# EasyEDA Pro project ProPrj_Another Person's ESP32 FRC DevKit Lite_2025-10-14.epro, board PCB6
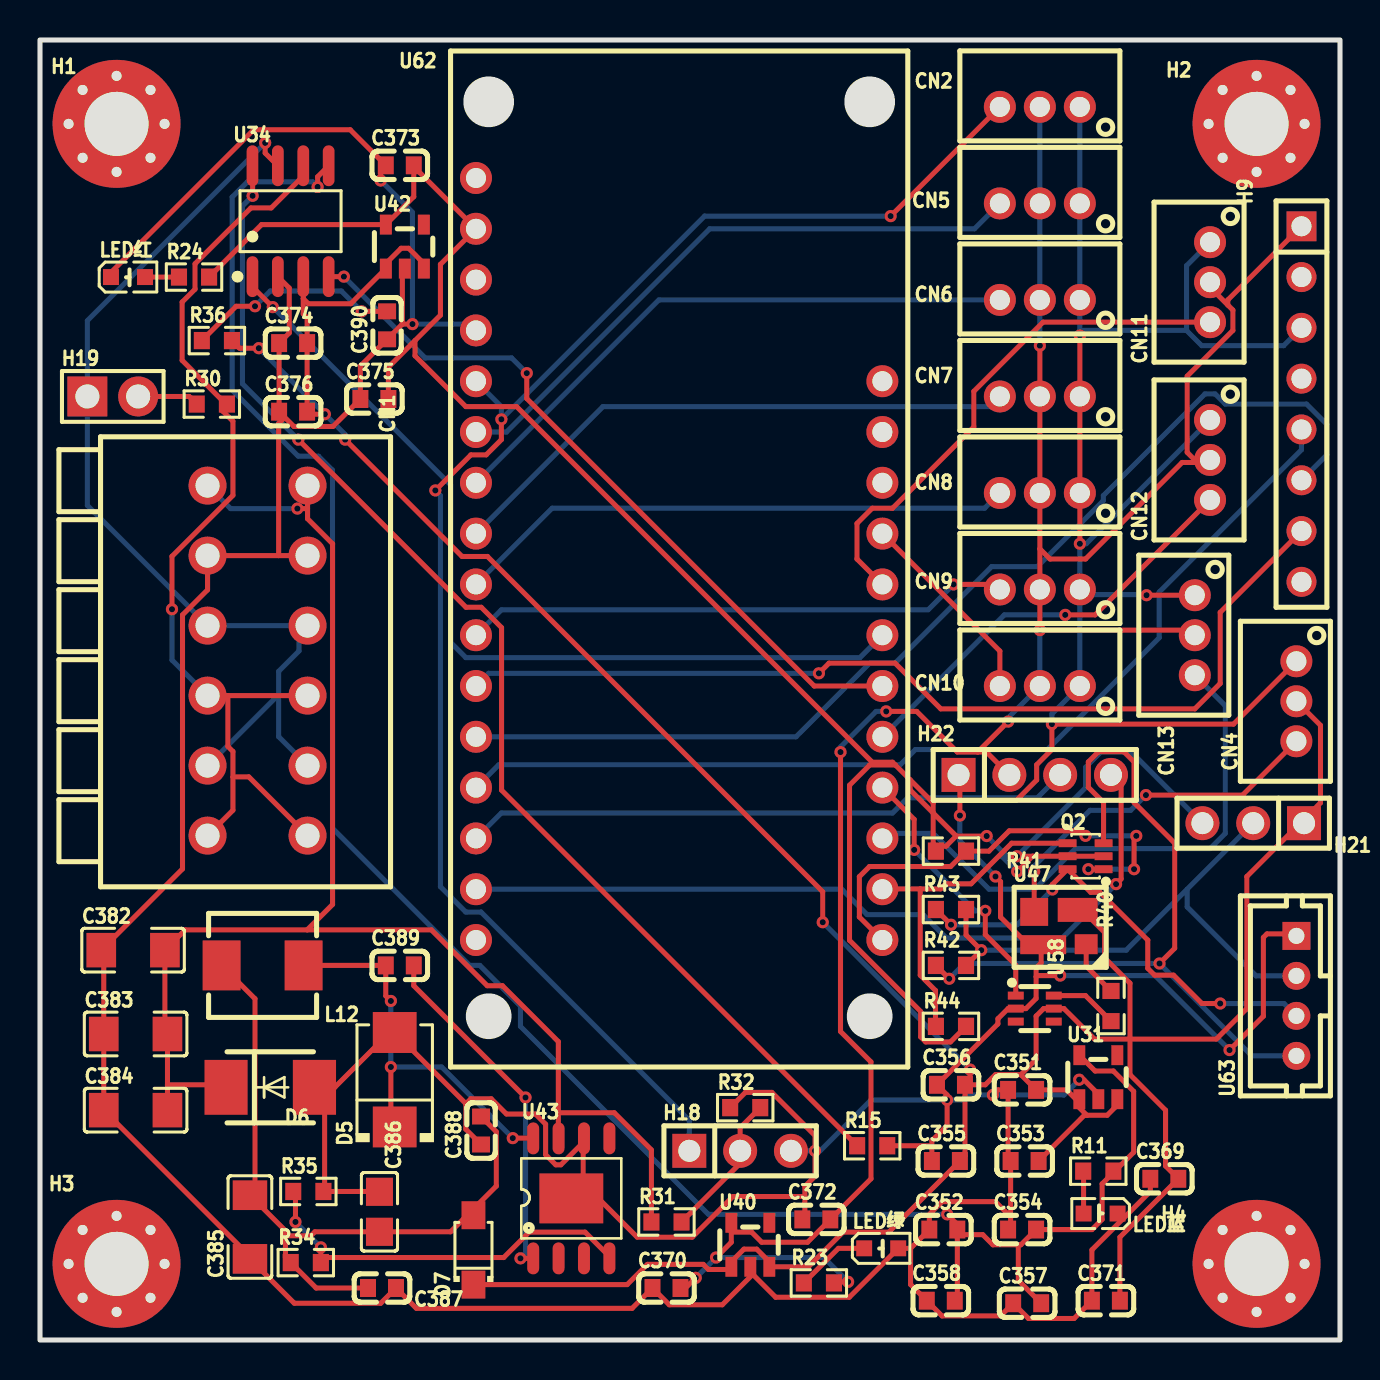
[diagram p9: board, top side]
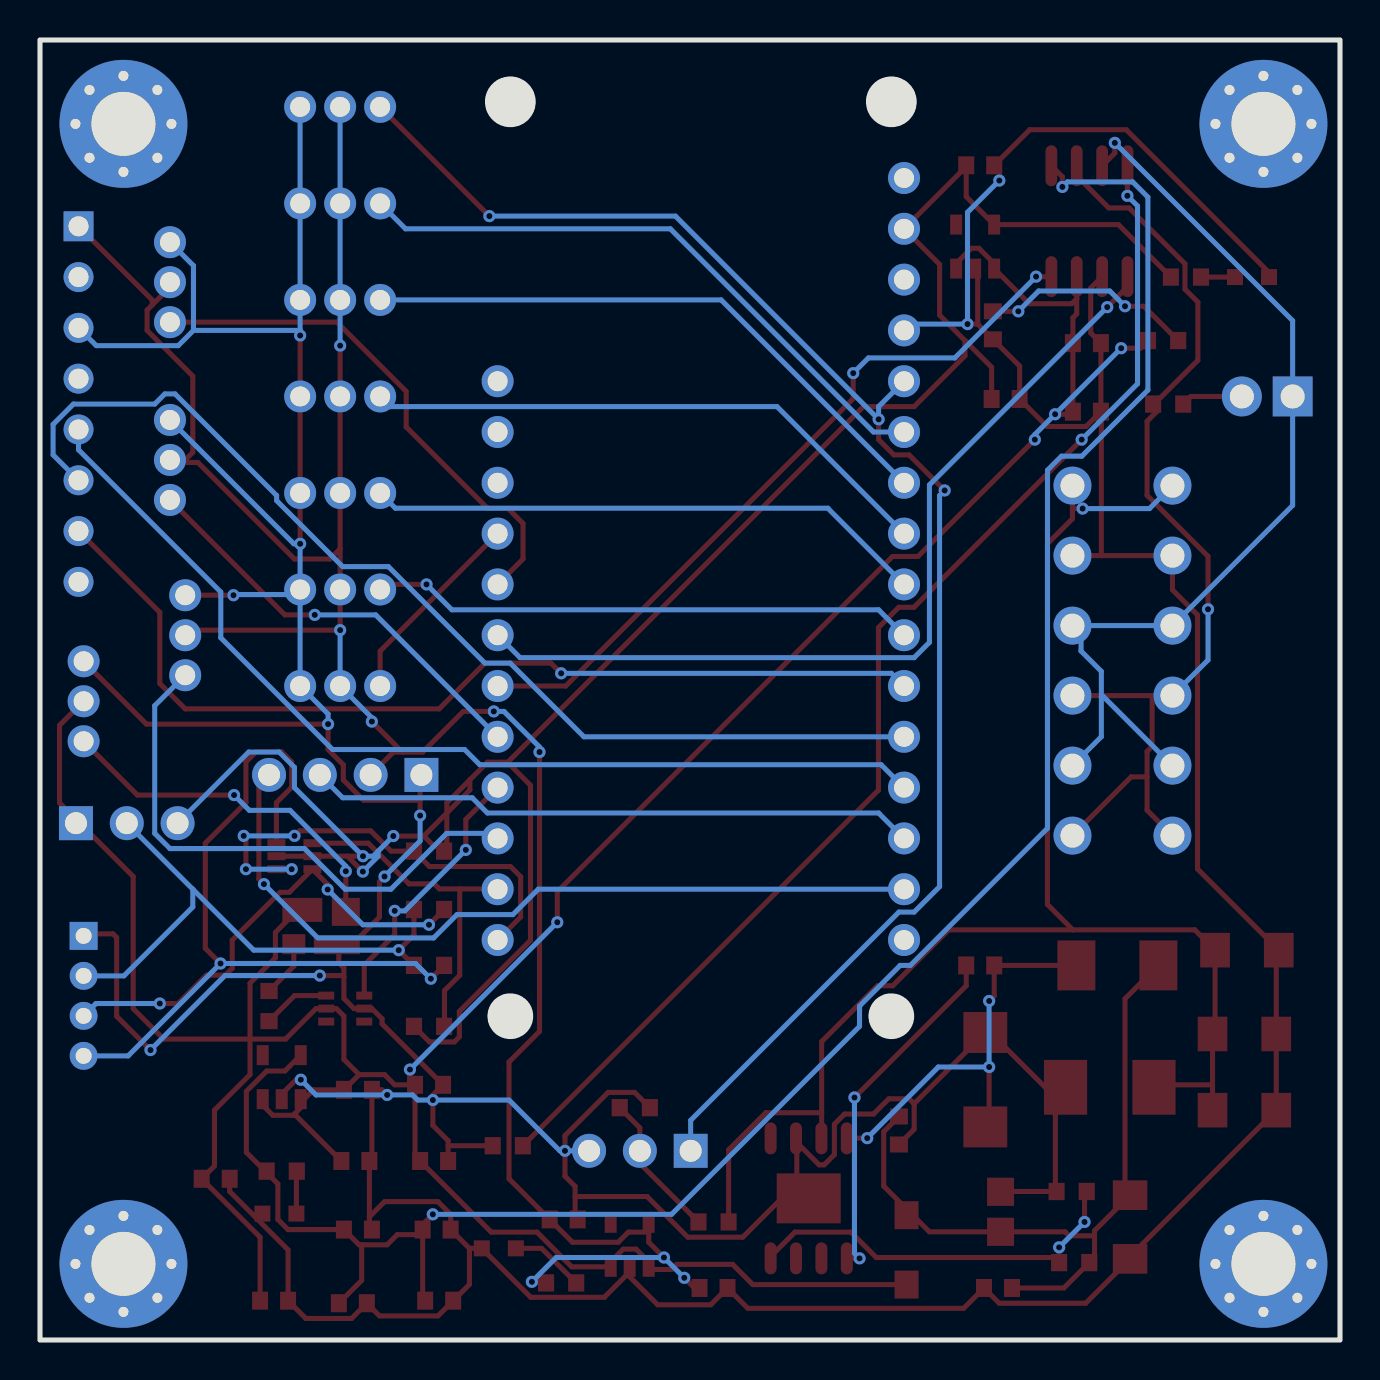
[diagram p10: board, bottom side, seen from below]

Outline 65 x 65 mm; copper layers: Top Layer, Bottom Layer. Coordinates in mm from the lower left corner of the outline.
Outline path: rectangle 0,65 65,0
Stack: Top Layer 0.035mm / Dielectric1 1.51mm FR4 er 4.5 / Bottom Layer 0.035mm

## Design rules (mm)
template: JLCPCB Capability(Two Layers Board)
spacing copperThickness1oz (default): track to track 0.102, other pairs 0.152 to 0.3
spacing copperThickness2oz: track to track 0.203, other pairs 0.152 to 0.3
track width copperThickness1oz (default): min 0.127, default 0.254, max 2.54
track width copperThickness2oz: min 0.203, default 0.254, max 2.54
differential pair differentialPair (default): width min 0.127, default 0.254, max 2.54; gap min 0.152, default 0.152
via viaSize (default): diameter min 0.5, default 0.61, max 10; hole min 0.3, default 0.305, max 6.3

## Placement (name value [footprint] x y rotation side)
C351  10uF  [C0603]  49.1 12.51 0 top
C352  10uF  [C0603]  45.17 5.52 0 top
C353  100nF  [C0603]  49.23 8.95 0 top
C354  100nF  [C0603]  49.1 5.52 0 top
C355  10uF  [C0603]  45.29 8.95 0 top
C356  100nF  [C0603]  45.55 12.76 0 top
C357  10uF  [C0603]  49.36 1.84 0 top
C358  100nF  [C0603]  45.04 1.97 0 top
C369  10uF  [C0603]  56.22 8.06 0 top
C370  10uF  [C0603]  31.32 2.6 0 top
C371  100nF  [C0603]  53.3 1.97 0 top
C372  100nF  [C0603]  38.82 6.03 0 top
C373  10uF  [C0603]  17.99 58.73 0 top
C374  100nF  [C0603]  12.66 49.84 0 top
C375  100nF  [C0603]  16.72 47.05 0 top
C376  10uF  [C0603]  12.66 46.42 0 top
C382  10uF  [C1206]  4.65 19.49 0 top
C383  22uF  [C1206]  4.78 15.3 0 top
C384  100nF  [C1206]  4.78 11.49 0 top
C385  47uF  [C1206]  10.5 5.65 90 top
C386  22uF  [C0805]  16.97 6.41 270 top
C387  10uF  [C0603]  17.1 2.6 180 top
C388  100nF  [C0603]  22.05 10.47 90 top
C389  100nF  [C0603]  17.99 18.73 0 top
C390  4.7uF  [C0603]  17.35 50.73 90 top
CN1  New_Library_2601-1106  [CONN-TH_2601-1106]  10.88 33.97 270 top
CN2  B3B-PH-K-S(LF)(SN)  [CONN-TH_B3B-PH-K-S]  49.99 61.66 0 top
CN4  B3B-PH-K-S(LF)(SN)  [CONN-TH_B3B-PH-K-S]  62.82 31.94 90 top
CN5  B3B-PH-K-S(LF)(SN)  [CONN-TH_B3B-PH-K-S]  49.99 56.83 0 top
CN6  B3B-PH-K-S(LF)(SN)  [CONN-TH_B3B-PH-K-S]  49.99 52 0 top
CN7  B3B-PH-K-S(LF)(SN)  [CONN-TH_B3B-PH-K-S]  49.99 47.18 0 top
CN8  B3B-PH-K-S(LF)(SN)  [CONN-TH_B3B-PH-K-S]  49.99 42.35 0 top
CN9  B3B-PH-K-S(LF)(SN)  [CONN-TH_B3B-PH-K-S]  49.99 37.53 0 top
CN10  B3B-PH-K-S(LF)(SN)  [CONN-TH_B3B-PH-K-S]  49.99 32.7 0 top
CN11  B3B-PH-K-S(LF)(SN)  [CONN-TH_B3B-PH-K-S]  58.5 52.89 90 top
CN12  B3B-PH-K-S(LF)(SN)  [CONN-TH_B3B-PH-K-S]  58.5 44 90 top
CN13  B3B-PH-K-S(LF)(SN)  [CONN-TH_B3B-PH-K-S]  57.74 35.24 90 top
D5  SS54SMB  [SMB_L4.6-W3.6-LS5.3-RD]  17.74 13.01 90 top
D6  SMBJ28A  [SMB_L4.6-W3.6-LS5.3-L-FD]  11.51 12.63 180 top
D7  DSK34  [SOD-123FL_L2.7-W1.8-LS3.8-RD]  21.67 4.51 90 top
H1  Hole_Pad  [MountingHole:MountingHole_3.2mm_M3_Pad_Via]  3.83 60.81 0 top
H2  Hole_Pad  [MountingHole:MountingHole_3.2mm_M3_Pad_Via]  60.83 60.81 0 top
H3  Hole_Pad  [MountingHole:MountingHole_3.2mm_M3_Pad_Via]  3.83 3.81 0 top
H4  Hole_Pad  [MountingHole:MountingHole_3.2mm_M3_Pad_Via]  60.83 3.81 0 top
H9  PZ254V-11-08P  [HDR-TH_8P-P2.54-V-M]  63.07 46.8 270 top
H18  PZ254V-11-03P  [HDR-TH_3P-P2.54-V-M]  35.01 9.46 0 top
H19  PZ254V-11-02P  [HDR-TH_2P-P2.54-V-M]  3.64 47.18 0 top
H21  PZ254V-11-03P  [HDR-TH_3P-P2.54-V-M]  60.66 25.84 180 top
H22  PZ254V-11-04P  [HDR-TH_4P-P2.54-V-M]  49.74 28.25 0 top
L12  10uH  [IND-SMD_L5.4-W5.2_FXL0530]  11.13 18.73 180 top
LED红  SZYY0603R  [LED0603-R-RD]  4.4 53.15 0 top
LED绿  XL-1608PGC-06  [LED0603-RD_GREEN]  42.12 4.63 0 top
LED蓝  SZYY0603B  [LED0603-R-RD_BLUE]  53.04 6.28 180 top
Q2  BSS138BKS,115  [SOT-363_L2.0-W1.3-P0.65-LS2.1-BR]  52.28 24.19 0 top
R11  10kΩ  [R0603]  52.91 8.44 0 top
R15  0Ω  [R0603]  41.61 9.71 0 top
R23  10kΩ  [R0603]  38.94 2.85 0 top
R24  10kΩ  [R0603]  7.7 53.15 0 top
R30  120Ω  [R0603]  8.59 46.8 0 top
R31  82kΩ  [R0603]  31.32 5.9 0 top
R32  10kΩ  [R0603]  35.26 11.62 0 top
R34  10kΩ  [R0603]  13.29 3.87 0 top
R35  31.3kΩ  [R0603]  13.42 7.43 0 top
R36  470kΩ  [R0603]  8.84 49.97 0 top
R40  500  [R0603]  53.55 16.7 270 top
R41  10kΩ  [R0603]  45.55 24.44 180 top
R42  10kΩ  [R0603]  45.55 18.73 0 top
R43  10kΩ  [R0603]  45.55 21.52 0 top
R44  10kΩ  [R0603]  45.55 15.68 0 top
U31  ME6211C30M5G-N  [SOT-23-5_L2.9-W1.6-P0.95-LS2.8-BL]  52.91 13.14 0 top
U34  TJA1051T/3/1J  [SOIC-8_L4.9-W3.9-P1.27-LS6.0-BL]  12.53 55.94 0 top
U40  ME6211C30M5G-N  [SOT-23-5_L2.9-W1.6-P0.95-LS2.8-BL]  35.52 4.76 0 top
U42  ME6211C30M5G-N  [SOT-23-5_L2.9-W1.6-P0.95-LS2.8-BL]  18.24 54.67 0 top
U43  TPS5450MDDAREP  [POWERPAD-SO-8_L4.9-W3.9-P1.27-LS6.0-BL-EP]  26.56 7.08 0 top
U47  SK6812MINI-C  [LED-SMD_4P-L3.5-W3.5-R-SK6812MINI]  51.01 20.63 0 top
U58  74HCT2G34GW,125  [SC-88-6_L2.0-W1.3-P0.65-LS2.1-BL]  49.74 16.57 270 top
U62  ESP32-C6-Feather  [COMM-TH_L50.8-W22.9-P2.54-LS20.32]  31.96 39.05 270 top
U63  B4B-PH-K(LF)(SN)  [CONN-TH_B4B-PH-K-LF-SN]  62.82 17.21 90 top

## Footprints (pads in the part's own frame, mm; a bottom-side part is the same pattern mirrored in y, then rotated)
C0603
  rect 0.8x0.9 smd: 1(-0.7,0) 2(0.7,0)
C0805
  rect 1.41x1.35 smd: 1(-1,0) 2(1,0)
C1206
  rect 1.485x1.728 smd: 1(-1.593,0) 2(1.593,0)
COMM-TH_L50.8-W22.9-P2.54-LS20.32
  round 1.6 hole 1: 1(-19.05,-10.16) 2(-16.51,-10.16) 3(-13.97,-10.16) 4(-11.43,-10.16) 5(-8.89,-10.16) 6(-6.35,-10.16) 7(-3.81,-10.16) 8(-1.27,-10.16) 9(1.27,-10.16) 10(3.81,-10.16) 11(6.35,-10.16) 12(8.89,-10.16) 13(11.43,-10.16) 14(13.97,-10.16) 15(16.51,-10.16) 16(19.05,-10.16) 17(19.05,10.16) 18(16.51,10.16) 19(13.97,10.16) 20(11.43,10.16) 21(8.89,10.16) 22(6.35,10.16) 23(3.81,10.16) 24(1.27,10.16) 25(-1.27,10.16) 26(-3.81,10.16) 27(-6.35,10.16) 28(-8.89,10.16)
CONN-TH_2601-1106
  round 1.9 hole 1.2: 1(-8.75,2.5) 1(-8.75,-2.5) 2(-5.25,2.5) 2(-5.25,-2.5) 3(-1.75,2.5) 3(-1.75,-2.5) 4(1.75,2.5) 4(1.75,-2.5) 5(5.25,2.5) 5(5.25,-2.5) 6(8.75,2.5) 6(8.75,-2.5)
CONN-TH_B3B-PH-K-S
  round 1.6 hole 1: 1(2,0) 2(0,0) 3(-2,0)
CONN-TH_B4B-PH-K-LF-SN
  rect 1.4x1.4 hole 0.8: 1(3,0)
  round 1.4 hole 0.8: 2(1,0) 3(-1,0) 4(-3,0)
HDR-TH_2P-P2.54-V-M
  rect 2x2 hole 1.2: 1(-1.27,0)
  round 2 hole 1.2: 2(1.27,0)
HDR-TH_3P-P2.54-V-M
  rect 1.7x1.7 hole 1.1: 1(-2.54,0)
  round 1.7 hole 1.1: 2(0,0) 3(2.54,0)
HDR-TH_4P-P2.54-V-M
  rect 1.7x1.7 hole 1.1: 1(-3.81,0)
  round 1.7 hole 1.1: 2(-1.27,0) 3(1.27,0) 4(3.81,0)
HDR-TH_8P-P2.54-V-M
  rect 1.5x1.5 hole 1: 1(-8.89,0)
  round 1.5 hole 1: 2(-6.35,0) 3(-3.81,0) 4(-1.27,0) 5(1.27,0) 6(3.81,0) 7(6.35,0) 8(8.89,0)
IND-SMD_L5.4-W5.2_FXL0530
  rect 1.9x2.5 smd: 1(-2.05,0) 2(2.05,0)
LED0603-R-RD
  rect 0.8x0.8 smd: 1(0.851,0) 2(-0.851,0)
LED0603-R-RD_BLUE
  rect 0.8x0.8 smd: 1(0.862,-0.038) 2(-0.841,-0.038)
LED0603-RD_GREEN
  rect 0.8x0.8 smd: 1(0.791,-0.05) 2(-0.911,-0.05)
LED-SMD_4P-L3.5-W3.5-R-SK6812MINI
  rect 1.15x1 smd: 1(1.3,-0.845)
  rect 2x1.2 smd: 2(0.875,0.87)
  rect 1.4x1.4 smd: 3(-1.3,0.77)
  rect 2.3x0.95 smd: 4(-0.85,-0.87)
MountingHole:MountingHole_3.2mm_M3_Pad_Via
  round 0.8 hole 0.5: 1(-2.4,0) 1(-1.697,1.697) 1(-1.697,-1.697) 1(0,2.4) 1(0,-2.4) 1(1.697,1.697) 1(1.697,-1.697) 1(2.4,0)
  round 6.4 hole 3.2: 1(0,0)
POWERPAD-SO-8_L4.9-W3.9-P1.27-LS6.0-BL-EP
  oval 0.6x1.6 smd: 1(-1.905,-3) 2(-0.635,-3) 3(0.635,-3) 4(1.905,-3) 5(1.905,3) 6(0.635,3) 7(-0.635,3) 8(-1.905,3)
  rect 3.2x2.5 smd: 9(0,0)
R0603
  rect 0.806x0.864 smd: 1(-0.753,0) 2(0.753,0)
SC-88-6_L2.0-W1.3-P0.65-LS2.1-BL
  rect 0.4x0.8 smd: 1(-0.65,-0.95) 2(0,-0.95) 3(0.65,-0.95) 4(0.65,0.95) 5(0,0.95) 6(-0.65,0.95)
SMB_L4.6-W3.6-LS5.3-L-FD
  rect 2.159x2.743 smd: 1(-2.21,0) 2(2.21,0)
SMB_L4.6-W3.6-LS5.3-RD
  rect 2.047x2.192 smd: 1(-2.361,0) 2(2.361,0)
SOD-123FL_L2.7-W1.8-LS3.8-RD
  rect 1.4x1.2 smd: 1(-1.735,0) 2(1.735,0)
SOIC-8_L4.9-W3.9-P1.27-LS6.0-BL
  oval 0.588x2.045 smd: 1(-1.905,-2.772) 2(-0.635,-2.772) 3(0.635,-2.772) 4(1.905,-2.772) 5(1.905,2.772) 6(0.635,2.772) 7(-0.635,2.772) 8(-1.905,2.772)
SOT-23-5_L2.9-W1.6-P0.95-LS2.8-BL
  rect 0.6x1 smd: 1(-0.95,-1.1) 2(0,-1.1) 3(0.95,-1.1) 4(0.95,1.1) 5(-0.95,1.1)
SOT-363_L2.0-W1.3-P0.65-LS2.1-BR
  rect 0.9x0.4 smd: 1(0.9,-0.65) 2(0.9,0) 3(0.9,0.65) 4(-0.9,0.65) 5(-0.9,0) 6(-0.9,-0.65)

## Nets
As in the schematic.

Pads without a net: H1 1; H2 1; H3 1; H4 1; H9 4; U31 4; U40 4; U42 4; U43 2 3 5; U58 3 4; U62 1 3 16 26 27 28

## Via types
v1: diameter 0.61, hole 0.305, Top Layer to Bottom Layer, 70 vias

## Routing (per net, layer and track width the routed paths; a pad name or vN(x,y) marks a point on that pad's centre or on a via; arc(x,y) is an arc through that point)
3V3: length 106.1
  Top Layer w0.254: 48.91,4.76 49.04,4.76 C354.2 52.6,5.52 53.11,6.03 53.11,7.81 53.67,8.37 ; 48.91,4.76 47.65,4.76 47.14,5.27 45.87,5.27 ; 48.91,4.76 48.91,2.98 C357.2 ; U34.5 13.88,58.16 v1(13.88,57.65) ; v1(45.36,6.28) 45.87,5.78 C352.2 45.87,5.27 ; 45.87,5.27 45.87,2.09 C358.2 ; 51.96,14.24 52.76,13.45 53.67,13.45 54.68,12.43 54.68,9.38 53.67,8.37 ; 53.67,8.37 R11.2
  Bottom Layer w0.254: v1(13.88,57.65) 13.63,57.91 10.37,57.91 9.61,57.15 9.61,47.49 12.91,44.19 13.93,44.19 14.62,43.49 14.62,25.59 21.48,18.73 21.99,18.73 24.02,16.7 24.02,15.68 33.42,6.28 v1(45.36,6.28)
3V3_POWER: length 114.7
  Top Layer w0.254: R24.2 11.08,55.77 U42.5 18.69,57.17 18.69,58.67 ; 43.51,28.01 44.66,26.86 44.66,26.35 ; 43.51,28.01 43.51,27.5 44.66,26.35 ; 43.51,28.01 42.76,28.75 ; 45.81,25.2 v1(47.33,25.2) ; 45.81,25.2 44.66,26.35 ; 45.81,25.2 45.3,24.69 44.79,24.69 ; 17.42,47.05 17.42,48.64 18.75,49.97 ; 18.75,49.97 18.75,49.21 21.29,46.67 23.83,46.67 41.61,28.89 42.63,28.89 42.76,28.75 ; 18.75,49.97 20.02,51.24 20.02,53.78 U62.2 18.69,58.67 ; v1(48.86,23.42) 49.63,24.19 ; 49.63,24.19 v1(48.85,24.19) ; 49.63,24.19 Q2.5 Q2.2 ; 18.69,58.67 C373.2 ; 44.79,24.69 44.66,24.83 44.66,26.35 ; 44.79,24.69 R41.2 ; 42.76,28.75 41.49,28.75 40.48,27.74 40.48,19.98 44.03,16.43 44.03,15.16 44.29,14.9 45.52,14.9 R44.2
  Bottom Layer w0.254: v1(48.86,23.42) 48.1,24.18 48.1,24.44 ; v1(47.33,25.2) 48.1,24.44 ; 48.1,24.44 48.34,24.19 v1(48.85,24.19) 52.28,27.62 52.28,28.64 53.04,29.4 54.56,29.4 H21.3
+5V: length 170.2
  Top Layer w0.254: 54.5,15.05 52.72,15.05 51.2,16.57 U58.5 50.18,16.57 49.8,16.19 49.8,14.03 49.04,13.27 ; 54.5,15.05 54.5,13.27 56.28,11.49 56.28,8.7 C369.2 54,5.14 C371.2 ; 54.5,15.05 54.5,17.84 53.23,19.11 53.23,20.38 52.33,21.28 52.11,21.28 U47.2 ; 54.5,15.05 58.82,15.05 60.34,16.57 60.34,23.17 63.01,25.84 ; 46.5,12.76 v1(46.5,13.52) ; 46.5,12.76 C356.2 46.25,9.2 C355.2 42.44,5.39 40.15,5.39 38.42,3.66 U40.3 36.47,3.91 35.84,4.54 35.19,4.54 34.69,4.04 34.69,3.78 34.43,3.53 33.42,3.53 33.16,3.78 30.37,3.78 29.36,2.77 D7.1 ; 46.5,12.76 47.26,12.76 47.77,13.27 49.04,13.27 ; v1(14.24,46.29) 13.48,46.29 C376.2 C374.2 13.35,51.11 13.16,51.31 13.16,52.07 ; 13.16,52.07 13.42,51.81 15.54,51.81 U42.1 17.29,53.82 18.06,54.59 18.43,54.59 19.19,53.82 U42.3 ; 13.16,52.07 13.16,53.17 ; 51.84,12 U31.1 ; 51.84,12 51.33,12.51 C351.2 49.04,13.27 ; 51.84,12 51.84,11.74 52.34,11.24 ; v1(15.26,45.02) 21.1,39.18 22.37,39.18 39.14,22.41 v1(39.14,20.89) ; 63.01,25.84 64.02,26.86 64.02,30.73 CN4.2 ; 63.01,25.84 H21.1 ; R36.2 9.98,49.59 v1(10.94,49.59) ; 49.93,8.95 52.22,11.24 52.34,11.24 ; 52.34,11.24 53.36,11.24 53.86,11.74 U31.3
  Bottom Layer w0.254: v1(15.26,45.02) 15.26,45.27 v1(14.24,46.29) v1(10.94,49.59) ; v1(46.5,13.52) v1(39.14,20.89)
GND: length 378.1
  Top Layer w0.254: 38.24,7.17 34.64,7.17 32.61,5.14 29.86,5.14 27.92,7.08 27.16,7.08 ; 38.24,7.17 38.24,7.68 38.75,8.19 v1(38.75,9.46) 38.75,10.22 36.59,12.38 35.27,12.38 R32.1 ; 38.24,7.17 38.24,6.16 38.12,6.03 ; 21.29,11.81 21.29,11.82 D5.2 17.48,15.38 14.74,12.63 14.23,12.63 ; 21.29,11.81 21.55,12.06 22.56,12.06 23.32,11.3 24.77,11.3 25.28,10.79 25.28,9.27 25.79,8.76 26.04,8.76 27.16,9.88 ; 21.29,11.81 21.29,10.54 C388.1 ; v1(17.03,57.97) 17.03,58.48 C373.1 15.51,60.51 10.69,60.51 3.55,53.38 LED红.2 ; 54.12,6.03 52.59,4.51 C371.1 51.71,1.08 49.42,1.08 C357.1 48.02,1.2 45.1,1.2 C358.1 43.53,2.78 43.53,4.58 ; 54.12,6.03 55.52,7.43 C369.1 ; 54.12,6.03 54.12,6.08 LED蓝.2 ; v1(46,26.22) 46,26.98 ; 46,26.98 46,28.19 H22.1 ; 46,26.98 48.82,26.98 49.83,28 49.83,28.76 50.6,29.52 v1(50.6,30.79) 59.68,30.79 CN4.1 ; 48.53,6.16 47.77,6.92 45.1,6.92 44.47,6.28 C352.1 43.53,4.58 ; 48.53,6.16 C353.1 48.4,9.08 C351.1 47.9,12.51 v1(47.64,12.25) ; 48.53,6.16 48.53,5.65 C354.1 ; 43.53,4.58 LED绿.1 40.46,2.14 36.78,2.14 35.64,3.28 ; 50.06,19.62 49.55,19.62 48.03,21.14 48.03,22.92 v1(47.77,23.17) ; 50.06,19.62 50.06,19.66 U47.4 ; 50.06,19.62 50.06,18.86 49.81,18.6 49.81,18.16 ; 27.16,7.08 U43.9 ; 27.16,7.08 27.16,9.88 ; 11.93,39.22 CN1.2 ; 11.93,39.22 CN1.2 8.38,37.51 7.13,36.26 7.13,23.56 C382.1 3.19,19.36 C383.1 C384.1 10.5,4.18 C385.1 12.71,1.84 17.04,1.84 C387.1 18.82,1.58 29.61,1.58 C370.1 31.47,1.76 34.11,1.76 35.64,3.28 ; 11.93,39.22 11.93,45.82 12.19,46.08 12.19,46.18 ; v1(51.99,39.81) CN8.1 CN7.1 v1(51.99,50.23) ; v1(51.96,13.01) 52.19,13.01 52.91,12.3 U31.2 ; U42.2 18.12,53.44 18.12,50.8 ; U34.2 12.46,52.6 12.46,50.35 C374.1 C376.1 12.19,46.18 ; 49.81,18.16 49.81,17.08 49.3,16.57 U58.2 48.4,16.57 47.9,16.06 47.9,15.81 C356.1 45.36,12.25 v1(45.36,12) 45.36,10.73 44.59,9.97 44.59,9.71 ; 49.81,18.16 49.87,18.22 v1(51.01,18.22) ; U40.2 35.64,3.54 35.64,3.28 ; 12.19,46.18 12.69,45.68 14.64,45.68 C375.1 16.02,48.7 C390.1 18.12,50.8 ; 27.16,9.88 U43.6 ; C386.1 16.96,7.43 R35.2 14.23,7.49 14.23,12.63 ; v1(55.33,37.24) CN13.1 ; 44.59,9.71 C355.1 ; 44.59,9.71 R15.2 ; 18.12,50.8 v1(18.62,50.8) ; 14.23,12.63 D6.1 ; v1(59.48,14.5) 61.17,16.19 61.17,20.13 61.35,20.31 62.72,20.31 U63.1
  Bottom Layer w0.254: 51.99,50.48 57.33,50.48 ; 51.99,50.48 v1(51.99,50.23) ; 51.99,50.48 CN6.1 CN5.1 CN2.1 ; 57.33,50.48 57.33,53.72 CN11.1 ; 57.33,50.48 58.09,49.72 62.19,49.72 H9.3 ; 51.99,37.27 CN10.1 50.6,31.3 v1(50.6,30.79) ; 51.99,37.27 CN9.1 v1(51.99,39.81) 52.31,39.81 CN12.1 ; 51.99,37.27 55.3,37.27 v1(55.33,37.24) ; v1(46,26.22) 46,24.95 v1(47.77,23.17) ; v1(59.48,14.5) 55.75,18.22 v1(51.01,18.22) ; v1(17.03,57.97) 18.62,56.38 v1(18.62,50.8) 21.48,50.8 U62.4 ; H18.3 39.01,9.46 41.55,12 v1(45.36,12) 46.12,12 46.37,12.25 v1(47.64,12.25) 51.2,12.25 v1(51.96,13.01)
VCC: length 76
  Top Layer w0.254: 6.37,12.76 C384.2 ; 6.37,12.76 C383.2 6.25,15.43 C382.2 7.26,20.51 13.36,20.51 ; 6.37,12.76 9.18,12.76 D6.2 ; R31.1 30.57,9.5 28.71,11.36 25.92,11.36 ; 13.38,41.57 13.38,41.06 14.63,39.81 14.63,21.78 13.36,20.51 ; 13.38,41.57 v1(12.87,41.57) ; 13.38,41.57 CN1.1 ; 25.92,11.36 25.92,10.09 U43.7 ; 25.92,11.36 25.92,14.92 23.12,17.71 22.36,17.71 19.57,20.51 13.36,20.51
  Bottom Layer w0.254: v1(12.87,41.57) 9.53,41.57 CN1.1
3.3_SENSOR: length 121.8
  Top Layer w0.254: 57.87,43.88 58.38,43.88 CN12.2 ; 57.87,43.88 57.36,44.38 57.36,48.19 59.65,50.48 59.65,51.5 59.39,51.75 ; 57.87,43.88 57.1,43.88 52.28,39.05 50.5,39.05 49.99,39.56 ; 46.88,29.4 v1(48.41,30.92) ; 46.88,29.4 45.87,29.4 43.84,31.43 v1(42.31,31.43) ; 46.88,29.4 47.33,29.4 H22.2 ; v1(32.79,3.11) 32.28,2.6 C370.2 ; R23.2 39.75,2.91 v1(40.41,2.91) ; CN11.2 58.5,52.64 59.39,51.75 ; v1(40.03,29.4) 40.03,15.43 41.55,13.9 41.55,8.06 C372.2 38.37,4.89 36.09,4.89 35.58,5.39 34.56,5.39 ; 59.39,51.75 59.39,52 H9.1 ; 34.56,5.39 34.56,4.89 v1(33.8,4.12) ; 34.56,5.39 34.56,5.86 ; v1(49.99,49.72) CN7.2 CN8.2 49.99,39.56 ; CN13.2 57.49,35.49 v1(49.99,35.49) CN9.2 49.99,39.56
  Bottom Layer w0.254: CN2.2 CN5.2 CN6.2 v1(49.99,49.72) ; v1(32.79,3.11) v1(33.8,4.12) 39.19,4.12 v1(40.41,2.91) ; v1(40.03,29.4) 40.03,29.65 41.8,31.43 v1(42.31,31.43) ; v1(48.41,30.92) 48.41,31.11 CN10.2 v1(49.99,35.49)
A0: length 77.9
  Top Layer w0.254: v1(42.53,56.19) CN2.3 ; v1(19.77,42.48) 21.55,44.26 22.31,44.26 23.07,45.02 v1(23.07,46.03)
  Bottom Layer w0.254: U62.5 23.07,46.67 v1(23.07,46.03) 33.23,56.19 v1(42.53,56.19) ; H18.1 32.47,10.98 22.05,21.4 21.29,21.4 20.02,22.67 20.02,42.22 v1(19.77,42.48)
A1: length 30.9
  Bottom Layer w0.254: U62.6 23.32,45.4 33.48,55.56 46.72,55.56 CN5.3
A2: length 30
  Bottom Layer w0.254: CN6.3 30.94,52 U62.7
A3: length 29
  Bottom Layer w0.254: CN7.3 47.49,46.67 28.15,46.67 U62.8
A4: length 28.1
  Bottom Layer w0.254: U62.9 25.61,41.59 47.23,41.59 CN8.3
A5: length 27.4
  Top Layer w0.254: CN9.3 47.74,37.78 v1(45.68,37.78)
  Bottom Layer w0.254: U62.10 23.07,36.51 44.41,36.51 v1(45.68,37.78)
ADC: length 7.3
  Top Layer w0.254: R31.2 35.01,8.83 H18.2 35.01,10.61 R32.2
CAN_H: length 49.7
  Top Layer w0.254: v1(11.26,59.86) 11.26,59.35 U34.7
  Bottom Layer w0.254: 11.93,32.16 11.82,32.16 CN1.5 ; 11.93,32.16 11.93,33.43 12.95,34.45 12.95,35.72 ; 11.93,32.16 11.93,30.16 CN1.5 ; v1(11.26,59.86) 2.37,50.97 H19.1 2.37,41.73 CN1.3 12.95,35.72 ; 12.95,35.72 CN1.3
CAN_L: length 50.5
  Top Layer w0.254: v1(6.6,36.54) 6.6,39.19 9.65,42.23 9.65,45.94 9.14,46.44 9.14,46.59 ; 9.65,28.16 9.65,26.49 CN1.6 ; 9.65,28.16 9.65,29.43 9.39,29.68 9.39,32.22 ; 9.65,28.16 10.44,28.16 CN1.6 ; 9.14,46.59 9.14,46.95 7.11,48.98 7.11,51.89 7.75,52.54 7.75,53.81 10.55,56.6 11.56,56.6 13.09,58.13 13.09,58.64 13.16,58.71 ; 9.14,46.59 R30.2 ; 9.39,32.22 CN1.4 ; 9.39,32.22 CN1.4
  Bottom Layer w0.254: v1(6.6,36.54) 6.6,34 CN1.4
CAN_RX: length 36.9
  Top Layer w0.254: U62.22 38.71,32.7 24.34,47.07 v1(24.34,48.34) ; U34.4 v1(15.19,53.17)
  Bottom Layer w0.254: v1(15.19,53.17) 19.26,49.1 23.58,49.1 v1(24.34,48.34)
CAN_TX: length 44.8
  Top Layer w0.254: U34.1 10.62,52.66 v1(11.64,51.64)
  Bottom Layer w0.254: v1(11.64,51.64) 20.53,42.75 20.53,34.88 21.29,34.12 41,34.12 U62.23
FB: length 19.7
  Top Layer w0.254: 14.04,4.12 v1(14.04,4.63) ; 14.04,4.12 23.19,4.12 24.46,5.39 27.25,5.39 28.47,4.18 U43.4 ; 14.04,4.12 R34.2 ; v1(12.77,5.9) 12.77,7.32 R35.1
  Bottom Layer w0.254: v1(14.04,4.63) v1(12.77,5.9)
IO_A: length 10.1
  Top Layer w0.254: U62.25 47.99,34.45 CN10.3
IO_B: length 26.4
  Top Layer w0.254: U62.24 40.85,39.05 40.85,40.83 41.61,41.59 42.63,41.59 46.69,45.65 46.69,47.43 50.15,50.89 CN11.3
IO_C: length 21.3
  Top Layer w0.254: CN12.3 52.75,36.26 v1(51.26,36.26)
  Bottom Layer w0.254: U62.21 48.22,36.26 v1(51.26,36.26)
IO_D: length 28.1
  Bottom Layer w0.254: U62.19 42.37,25.33 44.66,25.33 47.45,22.54 49.74,22.54 51.77,24.57 58.5,24.57 59.26,25.33 59.26,31.72 CN13.3
IO_PWR: length 27.4
  Top Layer w0.254: R43.2 46.3,20.25 v1(47.06,19.49) R42.2
  Bottom Layer w0.254: 57.36,22.54 54.31,19.49 v1(47.06,19.49) ; 57.36,22.54 H21.2 ; 57.36,22.54 57.36,21.65 60.8,18.21 U63.2
MISO: length 50.6
  Bottom Layer w0.254: H9.5 63.07,44.51 55.96,37.4 55.96,35.11 50.37,29.52 43.77,29.52 43.01,28.76 22.94,28.76 U62.13
MOSI: length 53.7
  Bottom Layer w0.254: H9.6 64.34,44.26 64.34,45.78 63.33,46.8 59.26,46.8 58.76,47.3 58.25,47.3 53.17,42.22 53.17,41.97 49.87,38.67 47.58,38.67 42.75,33.84 41.48,33.84 37.8,30.16 U62.12
NPXL: length 13.5
  Top Layer w0.254: v1(43.71,24.51) 43.71,26.03 U62.20 ; v1(47.27,21.46) 47.27,20.27 48.79,18.74 U58.1
  Bottom Layer w0.254: v1(43.71,24.51) 46.76,21.46 v1(47.27,21.46)
RX: length 30.5
  Bottom Layer w0.254: U62.14 23.07,26.35 42.63,26.35 43.39,27.11 49.87,27.11 H22.3
SCK: length 48.5
  Top Layer w0.254: v1(38.94,33.33) 39.45,33.84 42.75,33.84 45.04,31.56 57.74,31.56 59.01,32.83 59.01,36.38 H9.7
  Bottom Layer w0.254: U62.11 22.43,33.33 v1(38.94,33.33)
SCL: length 38.9
  Top Layer w0.254: v1(45.46,18.06) R42.1 ; Q2.3 53.18,26.87 52.42,27.63 52.42,28.9 52.93,29.41 54.19,29.41 54.7,28.9 54.7,26.87 56.74,24.84 56.74,19.59 v1(55.97,18.83)
  Bottom Layer w0.254: U63.4 60.59,14.21 v1(55.97,18.83) 46.22,18.83 v1(45.46,18.06)
SCL_3V: length 17.4
  Top Layer w0.254: 44.01,22.55 42.13,22.55 U62.18 ; 44.01,22.55 45.03,22.55 45.28,22.81 46.55,22.81 48.59,24.84 Q2.4 ; 44.01,22.55 44.01,18.24 44.78,17.47 44.78,15.7 R44.1
SDA: length 23.5
  Top Layer w0.254: v1(59.01,16.82) 58.09,16.82 56.68,18.24 55.73,18.24 55.39,18.58 55.39,19.99 53,22.38 52.54,22.38 Q2.6 50.62,22.78 v1(50.62,22.52) ; v1(45.55,20.76) R43.1
  Bottom Layer w0.254: v1(59.01,16.82) 62.2,16.82 U63.3 ; v1(50.62,22.52) 48.85,20.76 v1(45.55,20.76)
SDA_3V: length 23.3
  Top Layer w0.254: U62.17 40.97,21.15 40.97,23.17 41.48,23.67 45.53,23.67 R41.1 47.45,24.44 48.47,25.46 52.02,25.46 v1(52.28,25.21) ; v1(54.7,23.54) 54.7,25.09 v1(54.81,25.21) ; Q2.1 v1(52.42,23.54)
  Bottom Layer w0.254: v1(52.42,23.54) v1(54.7,23.54) ; v1(54.81,25.21) v1(52.28,25.21)
TX: length 39.9
  Top Layer w0.254: H22.4 54.06,27.75 54.06,23.05 v1(53.8,22.79)
  Bottom Layer w0.254: U62.15 40.09,22.54 41.36,21.27 44.15,21.27 45.32,20.1 51.11,20.1 v1(53.8,22.79)
$1N3538: length 2.1
  Top Layer w0.254: R11.1 52.18,8.42 LED蓝.1
$1N6214: length 62.4
  Top Layer w0.254: R15.1 23.08,27.49 23.08,35.62 22.06,36.64 21.3,36.64 v1(12.92,45.02) ; U34.8 10.63,58.7 v1(10.63,57.21)
  Bottom Layer w0.254: v1(10.63,57.21) 10.12,56.7 10.12,47.81 v1(12.92,45.02)
$1N6447: length 3.1
  Top Layer w0.254: R30.1 7.46,47.18 H19.2
$1N10830: length 3.7
  Top Layer w0.254: LED绿.2 39.92,4.58 R23.1
$1N11549: length 1.7
  Top Layer w0.254: LED红.1 R24.1
$1N13650: length 21
  Top Layer w0.254: v1(17.54,13.65) 17.54,10.85 D5.1 ; v1(23.64,10.09) 24.65,10.09 U43.8 ; L12.1 C389.1 17.29,17.21 v1(17.54,16.95)
  Bottom Layer w0.254: v1(23.64,10.09) 20.08,13.65 v1(17.54,13.65) v1(17.54,16.95)
$1N13751: length 36.5
  Top Layer w0.254: L12.2 10.75,17.06 10.75,7.5 C385.2 12.27,5.46 12.27,5.21 ; C388.2 22.81,10.41 22.81,7.7 21.55,6.43 ; 21.55,6.43 21.55,6.37 D7.2 ; 21.55,6.43 20.53,5.41 C386.2 13.75,5.41 13.54,5.21 12.27,5.21 ; 12.27,5.21 12.27,4.13 R34.1 13.81,2.6 C387.2
$1N13789: length 17.7
  Top Layer w0.254: C389.2 18.69,17.71 v1(24.28,12.13) ; v1(24.02,4.08) U43.1
  Bottom Layer w0.254: v1(24.02,4.08) 24.28,4.34 v1(24.28,12.13)
$1N38886: length 10.7
  Top Layer w0.254: R36.1 9.81,51.69 v1(10.75,51.69) ; C390.2 v1(16.08,51.43)
  Bottom Layer w0.254: v1(10.75,51.69) 11.51,52.45 15.07,52.45 v1(16.08,51.43)
$1N70923: length 2.9
  Top Layer w0.254: 52.31,19.79 52.31,18.69 R40.1
$1N109686: length 18
  Top Layer w0.254: v1(55.3,27.25) 60.13,27.25 CN4.3 ; U47.3 v1(49.71,23.44)
  Bottom Layer w0.254: v1(55.3,27.25) 54.53,26.48 52.5,26.48 49.71,23.69 v1(49.71,23.44)
$1N109877: length 3.4
  Top Layer w0.254: R40.2 52.27,17.22 U58.6
